# Altium schematic sheet LCD.SchDoc: LCD 12x64 graficzny + translatory
size A4; DrawnBy: Damian Dolewski; Engineer: Damian Dolewski; DocumentNumber: 1; SheetNumber: 1; SheetTotal: 1
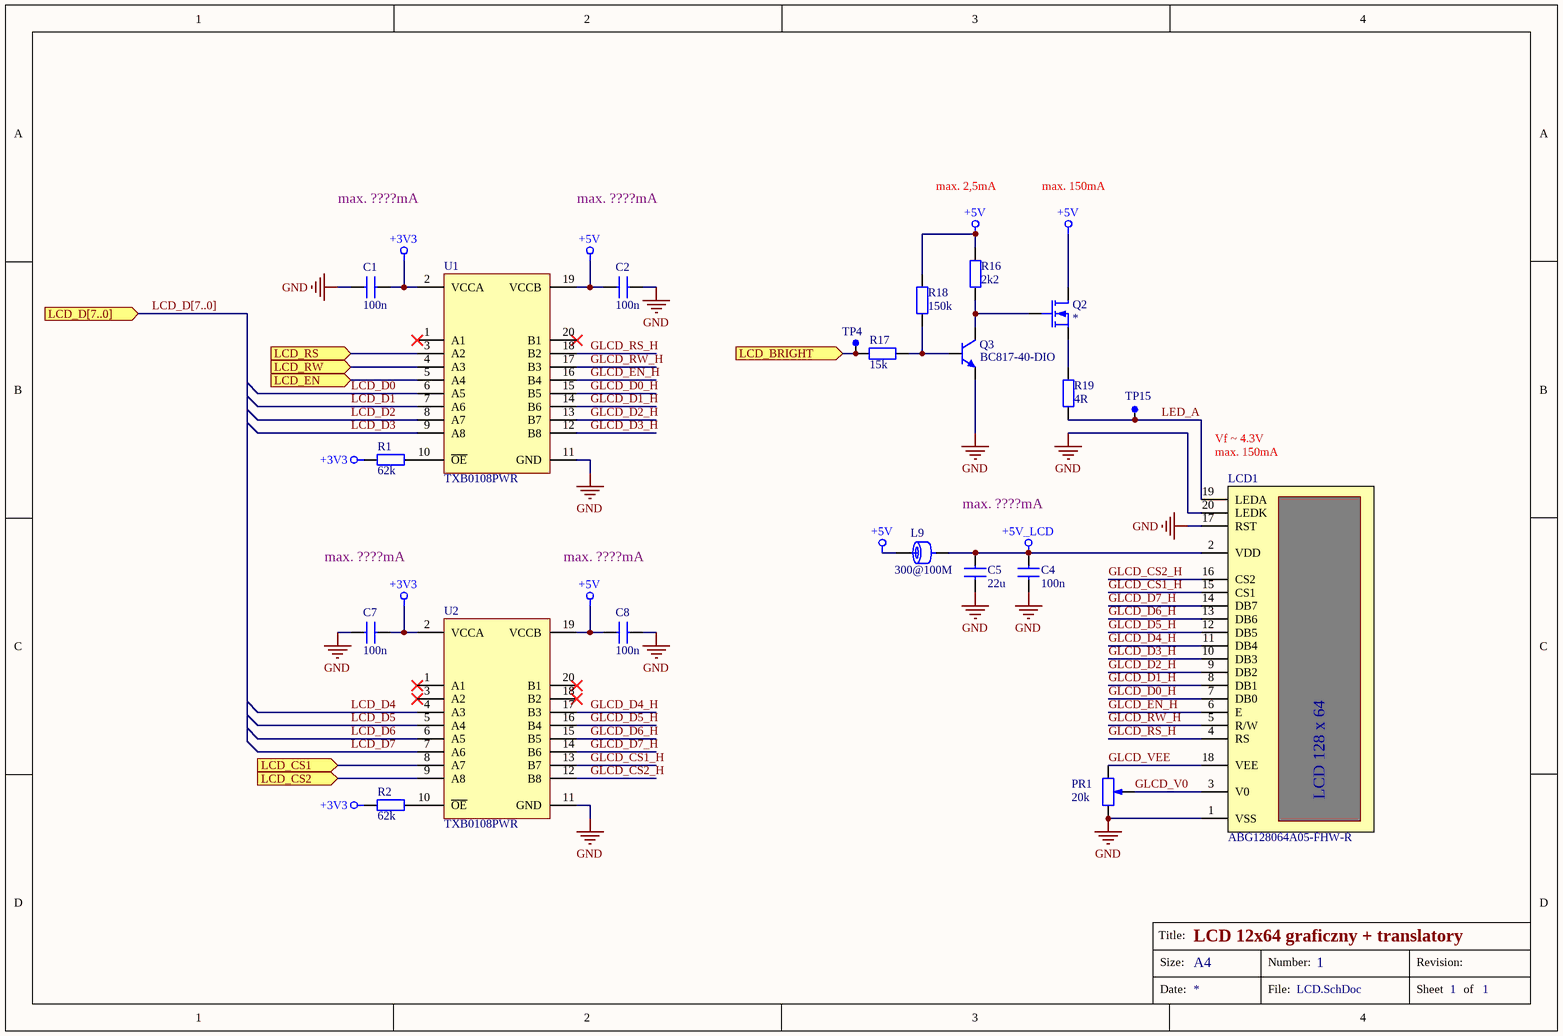
[diagram p0: LCD.SchDoc]

## Parts
C1  value 100n  [C_0805]  (hidden comment: Capacitor)
C2  value 100n  [C_0805]  (hidden comment: Capacitor)
C4  value 100n  [C_0805]  (hidden comment: Capacitor)
C5  value 22u  [C_0805]  (hidden comment: Capacitor)
C7  value 100n  [C_0805]  (hidden comment: Capacitor)
C8  value 100n  [C_0805]  (hidden comment: Capacitor)
L9  value 300@100M  [L_0805]  (hidden comment: 742792031)
LCD1  ABG128064A05-FHW-R  [GLCD]
PR1  T67W-20K  [1804 potentiometer]  (value not drawn)
Q2  MOSFET-N  [SOT-23]  (value not drawn)
Q3  BC817-40-DIO  [SOT-23]
R1  value 62k  [R_0805]  (hidden comment: Resistor)
R2  value 62k  [R_0805]  (hidden comment: Resistor)
R16  value 2k2  [R_0805]  (hidden comment: Resistor)
R17  value 15k  [R_0805]  (hidden comment: Resistor)
R18  value 150k  [R_0805]  (hidden comment: Resistor)
R19  value 4R  [R_1206]  (hidden comment: Resistor)
TP4  TEST PAD  [PIN]  (value not drawn)
TP15  TEST PAD  [PIN]  (value not drawn)
U1  TXB0108PWR  [TSSOP20]
U2  TXB0108PWR  [TSSOP20]

## Ports
LCD_BRIGHT (in), LCD_CS1 (in), LCD_CS2 (in), LCD_D[7..0] (in), LCD_EN (in), LCD_RS (in), LCD_RW (in)

## Nets
+3V3: C1.1 C7.1 R1.1 R2.1 U1.2(VCCA) U2.2(VCCA)
+5V: C2.2 C8.2 L9.1 Q2.3(D) R16.2 R18.2 U1.19(VCCB) U2.19(VCCB)
+5V_LCD: C4.1 C5.1 L9.2 LCD1.2(VDD)
GND: C1.2 C2.1 C4.2 C5.2 C7.2 C8.1 LCD1.1(VSS) LCD1.17(RST) LCD1.20(LEDK) PR1.1(BOT) Q3.2(E) U1.11(GND) U2.11(GND)
GLCD_CS1_H: LCD1.15(CS1) U2.13(B7)
GLCD_CS2_H: LCD1.16(CS2) U2.12(B8)
GLCD_D0_H: LCD1.7(DB0) U1.15(B5)
GLCD_D1_H: LCD1.8(DB1) U1.14(B6)
GLCD_D2_H: LCD1.9(DB2) U1.13(B7)
GLCD_D3_H: LCD1.10(DB3) U1.12(B8)
GLCD_D4_H: LCD1.11(DB4) U2.17(B3)
GLCD_D5_H: LCD1.12(DB5) U2.16(B4)
GLCD_D6_H: LCD1.13(DB6) U2.15(B5)
GLCD_D7_H: LCD1.14(DB7) U2.14(B6)
GLCD_EN_H: LCD1.6(E) U1.16(B4)
GLCD_RS_H: LCD1.4(RS) U1.18(B2)
GLCD_RW_H: LCD1.5(R/W) U1.17(B3)
GLCD_V0: LCD1.3(V0) PR1.2(TAP)
GLCD_VEE: LCD1.18(VEE) PR1.3(TOP)
LCD_BRIGHT: R17.1 TP4.1 ; port LCD_BRIGHT
LCD_CS1: U2.8(A7) ; port LCD_CS1
LCD_CS2: U2.9(A8) ; port LCD_CS2
LCD_D0: U1.6(A5)
LCD_D1: U1.7(A6)
LCD_D2: U1.8(A7)
LCD_D3: U1.9(A8)
LCD_D4: U2.4(A3)
LCD_D5: U2.5(A4)
LCD_D6: U2.6(A5)
LCD_D7: U2.7(A6)
LCD_EN: U1.5(A4) ; port LCD_EN
LCD_RS: U1.3(A2) ; port LCD_RS
LCD_RW: U1.4(A3) ; port LCD_RW
LED_A: LCD1.19(LEDA) R19.2 TP15.1
NetQ2_1: Q2.1(G) Q3.3(C) R16.1
NetQ2_2: Q2.2(S) R19.1
NetQ3_1: Q3.1(B) R17.2 R18.1
NetR1_2: R1.2 U1.10(~{OE})
NetR2_2: R2.2 U2.10(~{OE})

Not connected (* = marked no-connect by the designer): U1 1(A1)* 20(B1)*; U2 1(A1)* 3(A2)* 18(B2)* 20(B1)*

## Buses and harness runs
bus LCD_D[7..0] = port LCD_D[7..0]

## Notes on the sheet
- max. ????mA
- max. 2,5mA
- max. 150mA
- Vf ~ 4.3V
- (near LCD1) max. 150mA
- Title:
- Size:
- A4
- Number:
- Revision:
- Date:
- File:
- Sheet
- of
- (in symbol LCD 128x64) LCD 128 x 64
- (in symbol Potentiometer) 20k

## Library data of the parts
L9 = FB: Ferrite Bead
LCD1 = LCD 128x64: Graphic LCD 128x64
PR1 = Potentiometer: 3 pin Potentiometer
Q2 = MOSFET-N: N-Channel MOSFET; Value: *
Q3 = NPN: NPN Bipolar Transistor; Value: BC817-40-DIO
TP4 TP15 = TEST_PAD: PAD 1.5mm
U1 U2 = TXB0108: TXB0108 8-Bit Bidirectional Voltage-Level Translator with Auto-Direction Sensing and  ±15-kV ESD Protection; Value: TXB0108PWR